# Altium project plobot.PrjPCB
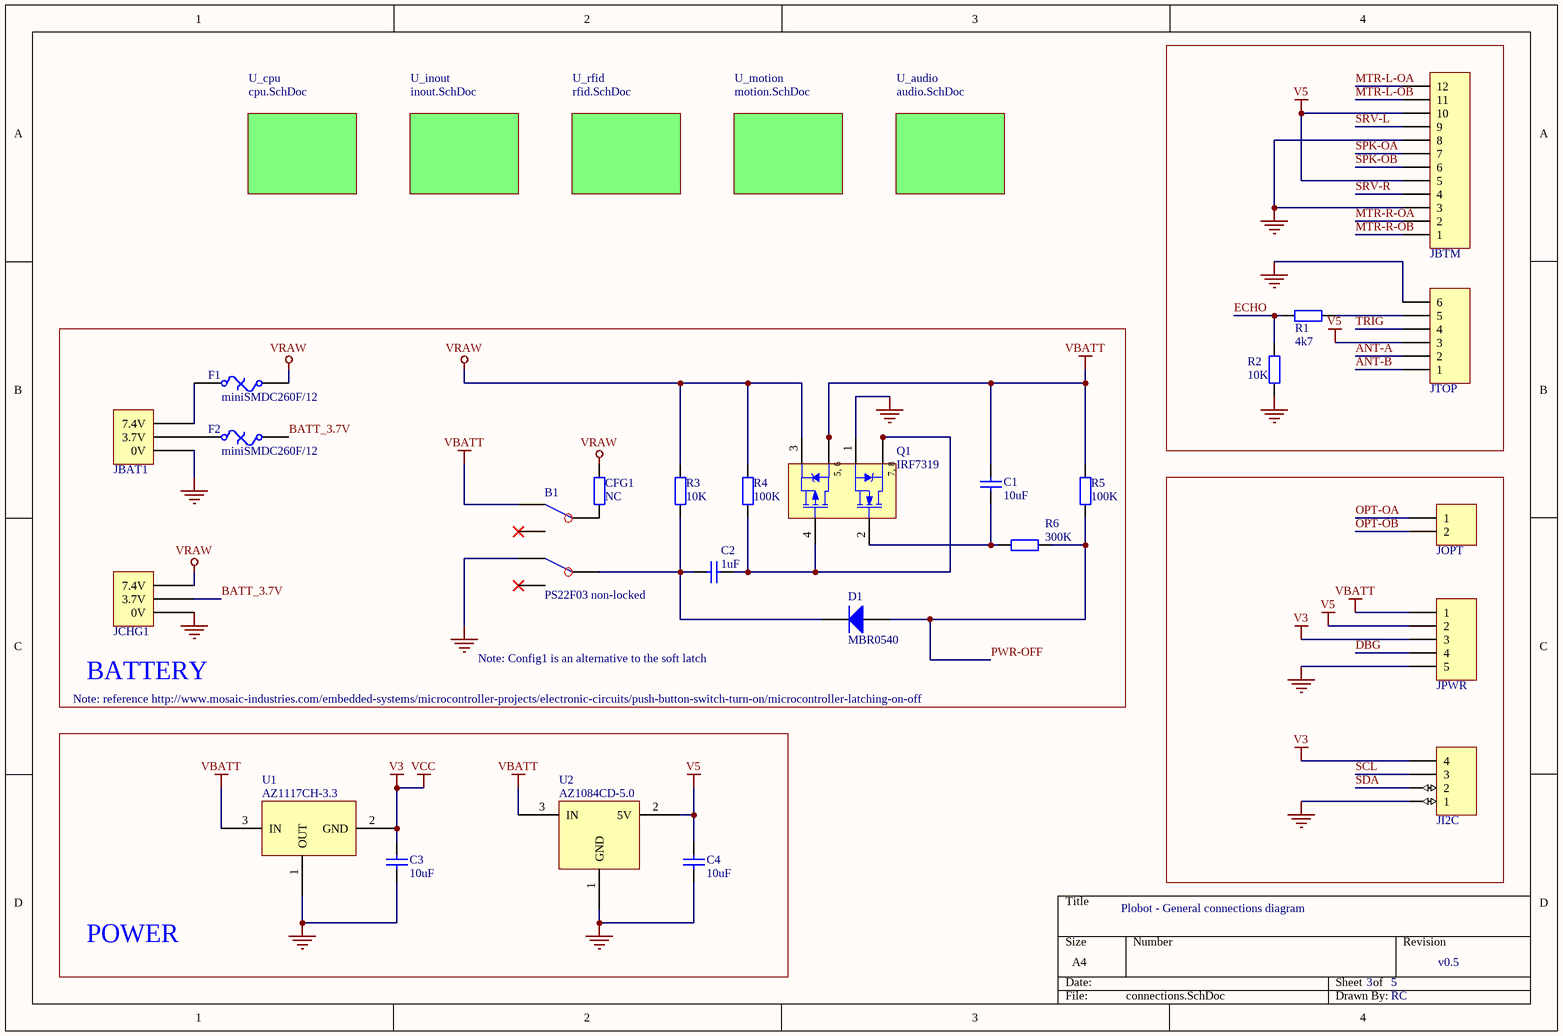
[diagram p0: connections.SchDoc]
6 sheets, 119 parts. Net scope: global (net labels, ports and power ports of the same name join across sheets).
Board file: plobot_draft.PcbDoc
Sheets:
  connections.SchDoc
    U_cpu = cpu.SchDoc
    U_inout = inout.SchDoc
    U_rfid = rfid.SchDoc
    U_motion = motion.SchDoc
    U_audio = audio.SchDoc

## Sheet connections.SchDoc
size A4; PageSetup: Record=PageOptions|CenterHorizontal=False|CenterVertical=False|PrintScale=1.00|XCorrection=1.00|YCorrection=1.00|PrintKind=1|BorderSize=5000000|LeftOffset=0|BottomOffset=0|Orientation=2|PaperLength=1000|PaperWidth=1000|Scale=100|PaperSource=7|PrintQuality=-4|MediaType=1|DitherType=10|PaperKind=A4|PrintScaleMode=0

### Parts
B1  PS22F03 non-locked  [KGPS22F03]
C1  10uF  [CAPC3216N]
C2  1uF  [CAPC3216N]
C3  10uF  [CAPC3216N]
C4  10uF  [CAPC3216N]
CFG1  NC  [RESC1608N]
D1  MBR0540  [SOD123/X.85]
F1  miniSMDC260F/12  [miniSMDC260F/12]
F2  miniSMDC260F/12  [miniSMDC260F/12]
JBAT1  Charger  [S3B-XH-A(LF)(SN)]  (value not drawn)
JBTM  Header 12  [JST-B12B-XH]  (value not drawn)
JCHG1  Charger  [S3B-XH-A( FEMALE )]  (value not drawn)
JI2C  Header 4  [HDR1X4]  (value not drawn)
JOPT  Header 2  [HDR1X2]  (value not drawn)
JPWR  Component  [HDR1X5]  (value not drawn)
JTOP  w/lock  [JST-B6B-XH]  (value not drawn)
Q1  IRF7319  [SO-8_L]
R1  value 4k7  [RESC1608N]  (hidden comment: 10k)
R2  10K  [RESC1608N]
R3  10K  [RESC1608N]
R4  100K  [RESC1608N]
R5  100K  [RESC1608N]
R6  300K  [RESC1608N]
U1  AZ1117CH-3.3  [SOT223]
U2  AZ1084CD-5.0  [AZ1084CD-5.0]

### Blocks framed on the sheet
BATTERY: B1 C1 C2 CFG1 D1 F1 F2 JBAT1 JCHG1 Q1 R3-R6
POWER: C3 C4 U1 U2

### Sub-sheets
U_audio = audio.SchDoc: no entries
U_cpu = cpu.SchDoc: no entries
U_inout = inout.SchDoc: no entries
U_motion = motion.SchDoc: no entries
U_rfid = rfid.SchDoc: no entries

### Nets
GND: B1.4 C3.2 C4.1 JBAT1.1(0V) JBTM.3 JBTM.8 JCHG1.1(0V) JI2C.1 JPWR.5 JTOP.6 Q1.1(S1) R2.2 U1.1(OUT) U2.1(GND)
V3: C3.1 JI2C.4 JPWR.3 U1.2(GND)  [also labelled VCC]
V5: C4.2 JBTM.5 JBTM.10 JPWR.2 JTOP.3 U2.2(5V)
VBATT: B1.3 C1.1 JPWR.1 Q1.5(D2) Q1.6(D2) R5.2 U1.3(IN) U2.3(IN)
VRAW: CFG1.1 F1.2 JCHG1.3(7.4V) Q1.3(S2) R3.2 R4.2
ANT-A: JTOP.2
ANT-B: JTOP.1
BATT_3.7V: F2.2 JCHG1.2(3.7V)
DBG: JPWR.4
ECHO: R1.1 R2.1
MTR-L-OA: JBTM.12
MTR-L-OB: JBTM.11
MTR-R-OA: JBTM.2
MTR-R-OB: JBTM.1
OPT-OA: JOPT.1
OPT-OB: JOPT.2
PWR-OFF: D1.2(A) R5.1 R6.1
SCL: JI2C.3
SDA: JI2C.2
SPK-OA: JBTM.7
SPK-OB: JBTM.6
SRV-L: JBTM.9
SRV-R: JBTM.4
TRIG: JTOP.4
NetB1_2: B1.2 CFG1.2
NetB1_5: B1.5 C2.1 D1.1(K) R3.1
NetC1_2: C1.2 Q1.2(G1) R6.2
NetC2_2: C2.2 Q1.4(G2) Q1.7(D1) Q1.8(D1) R4.1
NetF1_1: F1.1 JBAT1.3(7.4V)
NetF2_1: F2.1 JBAT1.2(3.7V)
NetJTOP_5: JTOP.5 R1.2

Not connected (* = marked no-connect by the designer): B1 1* 6*

### Notes on the sheet
- Note: reference http://www.mosaic-industries.com/embedded-systems/microcontroller-projects/electronic-circuits/push-button-switch-turn-on/microcontroller-latching-on-off
- Note: Config1 is an alternative to the soft latch
- Plobot - General connections diagram
- 3
- 5
- v0.5
- RC
- (in symbol IRF7319) 5, 6; 7, 8

### Library data of the parts
B1 = Component_1
C1-C4 = Cap_2: Capacitor; PackageReference: RAD-0.3
  C1: Value: 10uF; ComponentLink2Description: Datasheet; ComponentLink3Description: DIGIKEY
  C2: Value: 1uF; ComponentLink2Description: Datasheet; ComponentLink3Description: DIGIKEY
  C3: Published: 8-Jun-2000; LatestRevisionDate: 17-Jul-2002; LatestRevisionNote: Re-released for DXP Platform.; Publisher: Altium Limited; Value: 10uF; PackageDescription: Radial Cap, Thru-Hole; 2 Leads; 0.3 in Pin Spacing
  C4: Published: 8-Jun-2000; LatestRevisionDate: 17-Jul-2002; LatestRevisionNote: Re-released for DXP Platform.; Publisher: Altium Limited; PackageDescription: Radial Cap, Thru-Hole; 2 Leads; 0.3 in Pin Spacing; Value: 10uF
CFG1 R1 R3-R6 = Res2: Resistor; PackageReference: AXIAL-0.4
  CFG1: Value: NC; ComponentLink2Description: Datasheet; ComponentLink3Description: DIGIKEY
  R1: Published: 8-Jun-2000; LatestRevisionDate: 17-Jul-2002; LatestRevisionNote: Re-released for DXP Platform.; Publisher: Altium Limited
  R3: Value: 10K; ComponentLink3Description: DIGIKEY
  R4 R5: Value: 100K; ComponentLink3Description: DIGIKEY
  R6: Value: 300K; ComponentLink3Description: DIGIKEY
D1 = Diode: Default Diode; PackageReference: SMC; ComponentLink3Description: DIGIKEY; ComponentLink3URL: http://www.digikey.com/product-detail/en/fairchild-on-semiconductor/MBR0540/MBR0540TR-ND/1048787
F1 F2 = Fuse Thermal: Thermal Fuse; Published: 24-Mar-1999; LatestRevisionDate: 17-Jul-2002; LatestRevisionNote: Re-released for DXP Platform.; PackageReference: PIN-W2/E2.8; Publisher: Altium Limited
JBAT1 JCHG1 = BATTCON: ComponentLink3Description: TAOBAO; ComponentLink3URL: https://item.taobao.com/item.htm?spm=a1z09.2.0.0.HEqzjA&id=524112080121&_u=goqqgqg0b2c
JBTM = Header 12: Header, 12-Pin; ComponentLink2Description: http://www.digikey.com/product-detail/en/jst-sales-america-inc/B12B-XH-A(LF)(SN)/455-2259-ND/1651057; ComponentLink3Description: DIGIKEY
JI2C = Header 4: Header, 4-Pin; ComponentLink3Description: DIGIKEY
JOPT = Header 2: Header, 2-Pin; LatestRevisionDate: 17-Jul-2002; LatestRevisionNote: Re-released for DXP Platform.; Publisher: Altium Limited
JPWR = Header 5: Header, 5-Pin; LatestRevisionDate: 17-Jul-2002; LatestRevisionNote: Re-released for DXP Platform.; Publisher: Altium Limited
JTOP = Header 6: Header, 6-Pin; ComponentLink2Description: http://www.digikey.com/products/en?keywords=B6B-XH-A(LF)(SN); ComponentLink3Description: DIGIKEY
Q1 = IRF7319: HEXFET Power MOSFET; PackageReference: SO-8; ComponentLink1Description: Manufacturer Link; ComponentLink1URL: http://www.irf.com/; ComponentLink2Description: Datasheet; ComponentLink2URL: http://www.irf.com/product-info/datasheets/data/IRFN140.pdf; ComponentLink3Description: DIGIKEY; ComponentLink3URL: http://www.digikey.com/product-detail/en/infineon-technologies/IRF7319TRPBF/IRF7319PBFTR-ND/812747; Price: 0.4 USD
R2 = Res2: Resistor; Value: 20k; Published: 8-Jun-2000; LatestRevisionDate: 17-Jul-2002; LatestRevisionNote: Re-released for DXP Platform.; PackageReference: AXIAL-0.4; Publisher: Altium Limited
U1 = LM1117

## Sheet cpu.SchDoc
size A4
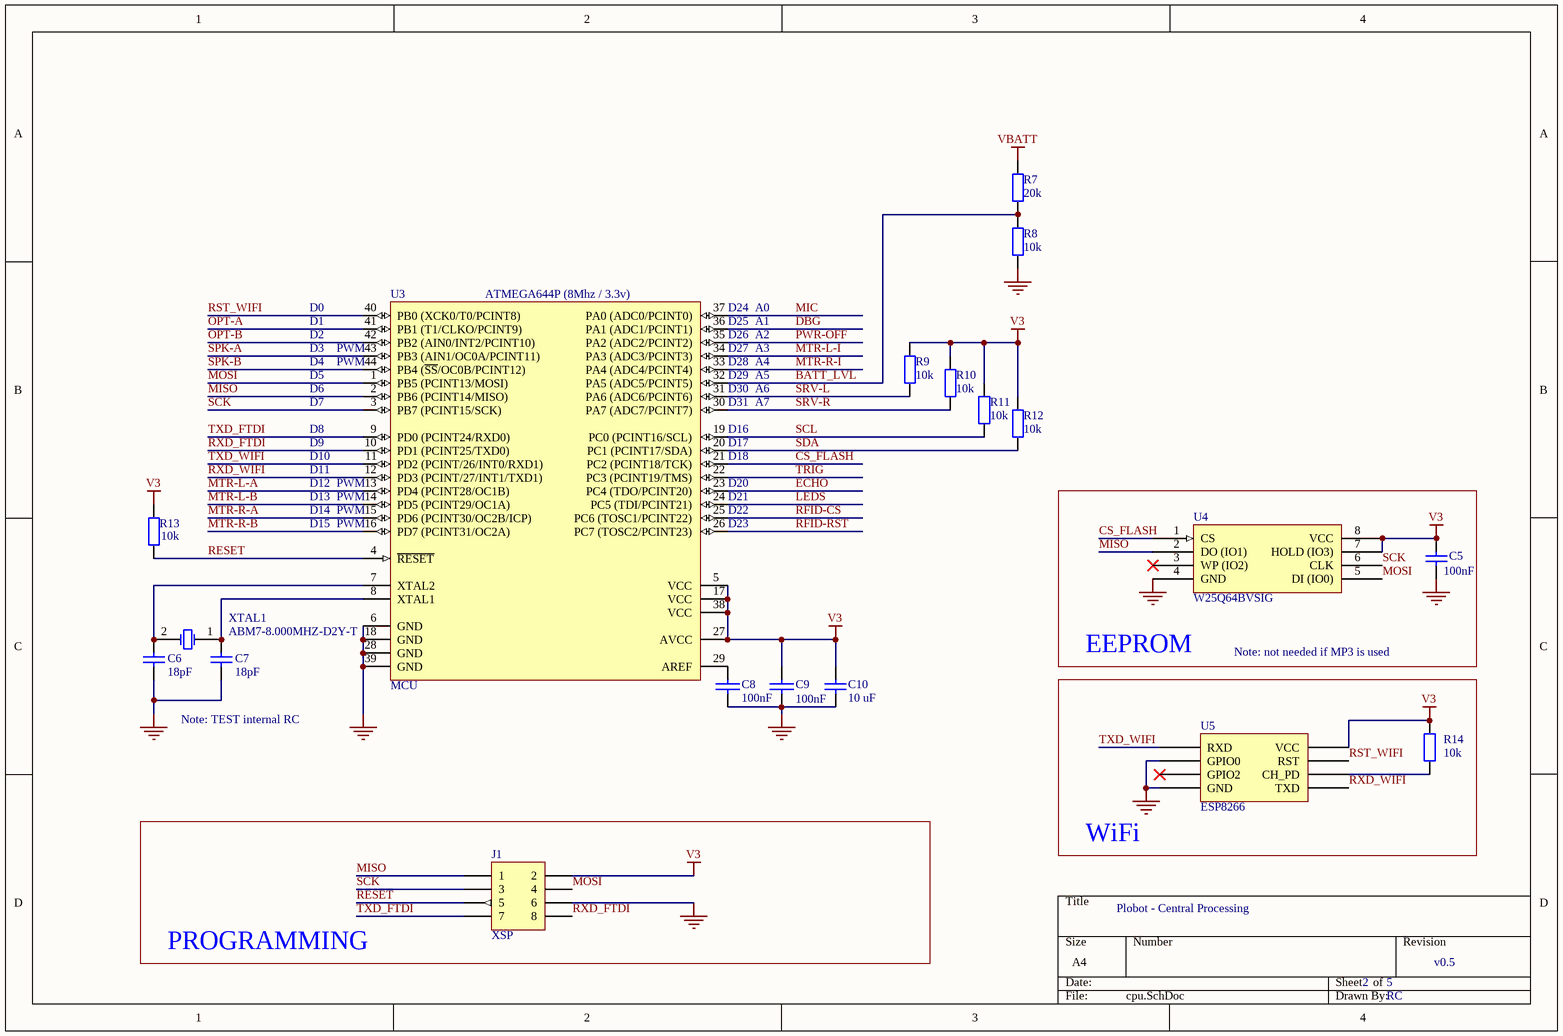
[diagram p1: cpu.SchDoc]

### Parts
C5  100nF  [CAPC1608N]
C6  18pF  [CAPC1608N]
C7  18pF  [CAPC1608N]
C8  100nF  [CAPC1608N]
C9  100nF  [CAPC1608N]
C10  10 uF  [CAPC3216N]
J1  XSP  [HDR2X4H]
R7  20k  [RESC1608N]
R8  10k  [RESC1608N]
R9  10k  [RESC1608N]
R10  10k  [RESC1608N]
R11  10k  [RESC1608N]
R12  10k  [RESC1608N]
R13  10k  [RESC1608N]
R14  10k  [RESC1608N]
U3  MCU  [atmega644p]
U4  W25Q64BVSIG  [W25Q64BVSIG]
U5  ESP8266  [ESP8266]
XTAL1  ABM7-8.000MHZ-D2Y-T  [XTAL]

### Blocks framed on the sheet
EEPROM: C5 U4
WiFi: R14 U5
PROGRAMMING: J1

### Nets
GND: C5.2 C6.1 C7.1 C8.2 C9.2 C10.1 J1.6 R8.1 U3.6(GND) U3.18(GND) U3.28(GND) U3.39(GND) U4.4(GND) U5.GND U5.GPIO0
V3: C5.1 C9.1 C10.2 J1.2 R9.1 R10.1 R11.2 R12.1 R13.1 R14.1 U3.5(VCC) U3.17(VCC) U3.27(AVCC) U3.38(VCC) U4.7(HOLD_(IO3)) U4.8(VCC) U5.VCC
VBATT: R7.2
BATT_LVL: R7.1 R8.2 U3.32(PA5_(ADC5/PCINT5))
CS_FLASH: U3.21(PC2_(PCINT18/TCK)) U4.1(CS)
DBG: U3.36(PA1_(ADC1/PCINT1))
ECHO: U3.23(PC4_(TDO/PCINT20))
LEDS: U3.24(PC5_(TDI/PCINT21))
MIC: U3.37(PA0_(ADC0/PCINT0))
MISO: J1.1 U3.2(PB6_(PCINT14/MISO)) U4.2(DO_(IO1))
MOSI: J1.4 U3.1(PB5_(PCINT13/MOSI)) U4.5(DI_(IO0))
MTR-L-A: U3.13(PD4_(PCINT28/OC1B))
MTR-L-B: U3.14(PD5_(PCINT29/OC1A))
MTR-L-I: U3.34(PA3_(ADC3/PCINT3))
MTR-R-A: U3.15(PD6_(PCINT30/OC2B/ICP))
MTR-R-B: U3.16(PD7_(PCINT31/OC2A))
MTR-R-I: U3.33(PA4_(ADC4/PCINT4))
OPT-A: U3.41(PB1_(T1/CLKO/PCINT9))
OPT-B: U3.42(PB2_(AIN0/INT2/PCINT10))
PWR-OFF: U3.35(PA2_(ADC2/PCINT2))
RESET: J1.5 R13.2 U3.4(~{RESET})
RFID-CS: U3.25(PC6_(TOSC1/PCINT22))
RFID-RST: U3.26(PC7_(TOSC2/PCINT23))
RST_WIFI: U3.40(PB0_(XCK0/T0/PCINT8)) U5.RST
RXD_FTDI: J1.8 U3.10(PD1_(PCINT25/TXD0))
RXD_WIFI: U3.12(PD3_(PCINT/27/INT1/TXD1)) U5.TXD
SCK: J1.3 U3.3(PB7_(PCINT15/SCK)) U4.6(CLK)
SCL: R11.1 U3.19(PC0_(PCINT16/SCL))
SDA: R12.2 U3.20(PC1_(PCINT17/SDA))
SPK-A: U3.43(PB3_(AIN1/OC0A/PCINT11))
SPK-B: U3.44(PB4_(~{SS}/OC0B/PCINT12))
SRV-L: R9.2 U3.31(PA6_(ADC6/PCINT6))
SRV-R: R10.2 U3.30(PA7_(ADC7/PCINT7))
TRIG: U3.22(PC3_(PCINT19/TMS))
TXD_FTDI: J1.7 U3.9(PD0_(PCINT24/RXD0))
TXD_WIFI: U3.11(PD2_(PCINT/26/INT0/RXD1)) U5.RXD
NetC6_2: C6.2 U3.7(XTAL2) XTAL1.2(OSC2)
NetC7_2: C7.2 U3.8(XTAL1) XTAL1.1(OSC1)
NetC8_1: C8.1 U3.29(AREF)
NetR14_2: R14.2 U5.CH_PD

Not connected (* = marked no-connect by the designer): U4 3(WP_(IO2))*; U5 GPIO2*

### Notes on the sheet
- D0
- (near U3) ATMEGA644P (8Mhz / 3.3v)
- (near U3) D24
- A0
- D1
- D2
- D3
- D4
- D5
- (near U3) PWM
- (near U3) D25
- (near U3) D26
- (near U3) D27
- (near U3) D28
- (near U3) D29
- A1
- A2
- A3
- A4
- A5
- D6
- D7
- D8
- D9
- (near U3) D16
- (near U3) D17
- (near U3) D30
- (near U3) D31
- A6
- A7
- D10
- D11
- D12
- D13
- D14
- (near U3) D18
- (near U3) D20
- (near U3) D21
- (near U3) D22
- D15
- (near U3) D23
- Note: not needed if MP3 is used
- Note: TEST internal RC
- Plobot - Central Processing
- 2
- 5
- v0.5
- RC

### Library data of the parts
C5-C9 = Cap: Capacitor
  C5: Published: 8-Jun-2000; LatestRevisionDate: 17-Jul-2002; LatestRevisionNote: Re-released for DXP Platform.; PackageReference: RAD-0.3; Publisher: Altium Limited; PackageDescription: Radial Cap, Thru-Hole; 2 Leads; 0.3 in Pin Spacing; Value: 100nF
  C6 C7: Published: 8-Jun-2000; LatestRevisionDate: 17-Jul-2002; LatestRevisionNote: Re-released for DXP Platform.; PackageReference: RAD-0.3; Publisher: Altium Limited; Value: 18pF
C10 = Cap_2: Capacitor; Published: 8-Jun-2000; LatestRevisionDate: 17-Jul-2002; LatestRevisionNote: Re-released for DXP Platform.; PackageReference: RAD-0.3; Publisher: Altium Limited; PackageDescription: Radial Cap, Thru-Hole; 2 Leads; 0.3 in Pin Spacing; Value: 10 uF
J1 = Header 4X2H: Header, 4-Pin, Dual row, Right Angle; LatestRevisionDate: 17-Jul-2002; LatestRevisionNote: Re-released for DXP Platform.; Publisher: Altium Limited
R7-R14 = Res2: Resistor; Published: 8-Jun-2000; LatestRevisionDate: 17-Jul-2002; LatestRevisionNote: Re-released for DXP Platform.; PackageReference: AXIAL-0.4; Publisher: Altium Limited
  R7: Value: 20k
  R8-R14: Value: 10k
U3 = ATmega644-20AU: 8-bit AVR Microcontroller, 2.7-5.5V, 20MHz, 64KB Flash, 2KB EEPROM, 4KB SRAM, 44-pin TQFP; DatasheetVersion: revN, Jul-2010; PackageVersion: revC, Oct-2010; PackageReference: 44A; PackageDescription: 44-Pin Plastic Thin Profile Quad Flat Pack, 10 x 10 x 1.0 mm Body, 0.8 mm Pitch (TQFP); Code_JEDEC: MS-026-ACB; ComponentLink1Description: Manufacturer URL; ComponentLink1URL: http://www.atmel.com/; ComponentLink2Description: ATmega644 Datasheet; ComponentLink2URL: http://www.atmel.com/dyn/resources/prod_documents/doc2593.pdf; ComponentLink3Description: ATmega644 Summary; ComponentLink3URL: http://www.atmel.com/dyn/resources/prod_documents/2593S.pdf

## Sheet inout.SchDoc
size A4
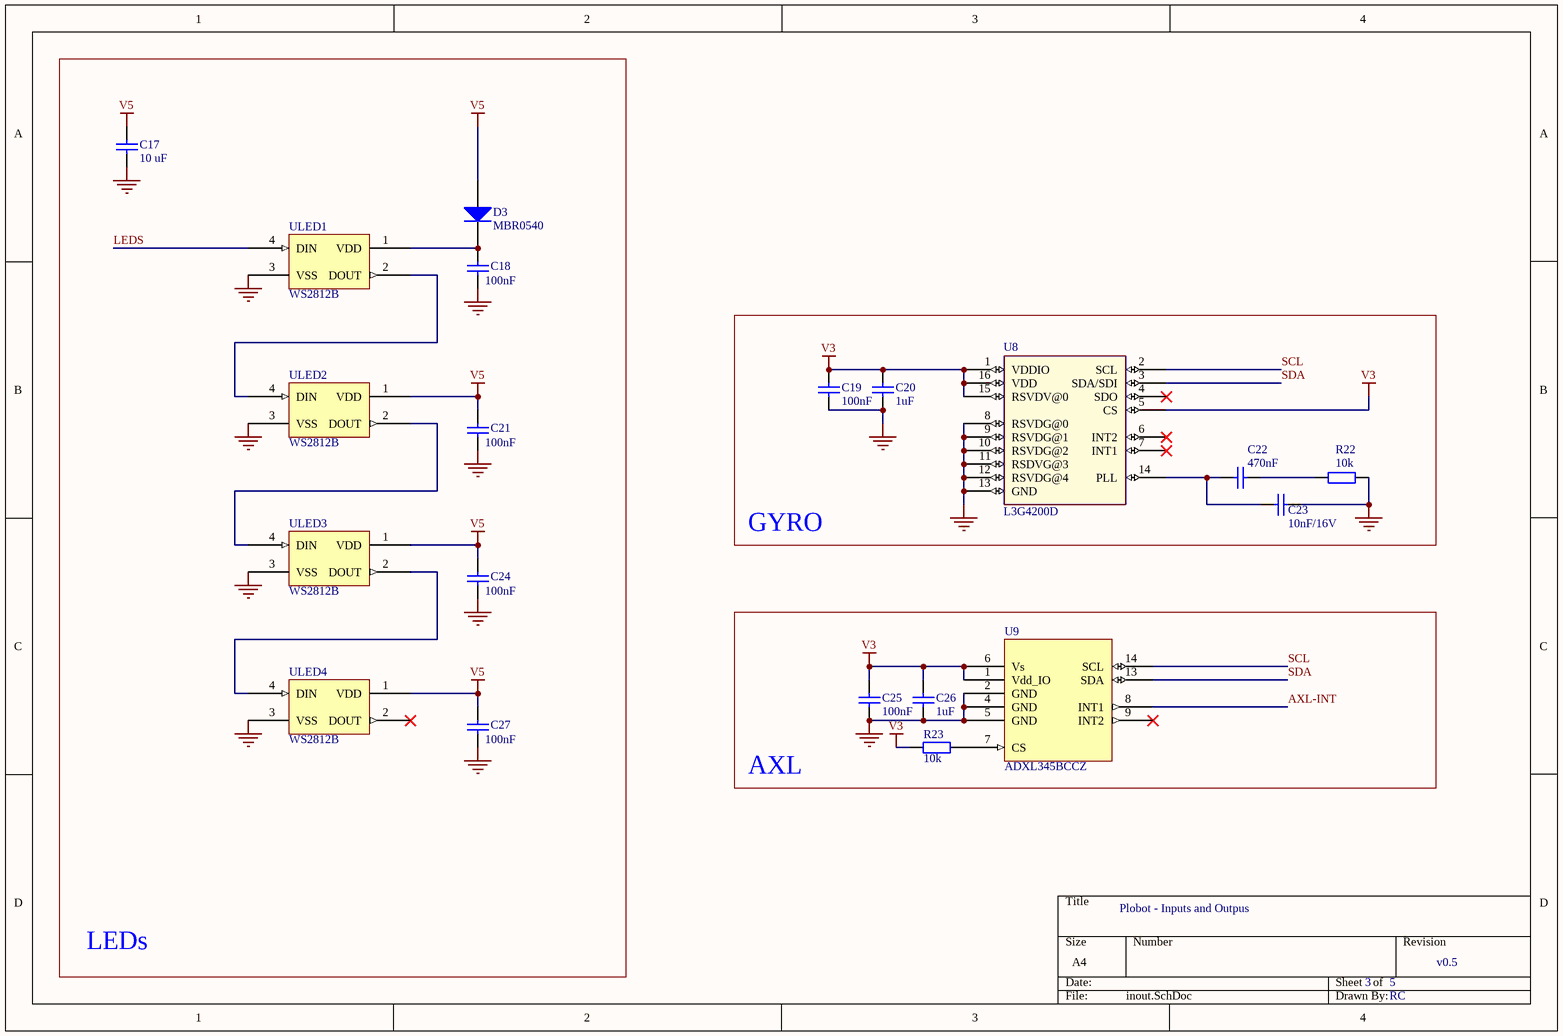
[diagram p2: inout.SchDoc]

### Parts
C17  10 uF  [CAPC3216N]
C18  100nF  [CAPC1608N]
C19  100nF  [CAPC1608N]
C20  1uF  [CAPC2012N]
C21  100nF  [CAPC1608N]
C22  470nF  [CAPC2012N]
C23  10nF/16V  [CAPC2012N]
C24  100nF  [CAPC1608N]
C25  100nF  [CAPC1608N]
C26  1uF  [CAPC2012N]
C27  100nF  [CAPC1608N]
D3  MBR0540  [SOD123/X.85]
R22  10k  [RESC1608N]
R23  10k  [RESC1608N]
U8  L3G4200D  [LGA16-4X4]
U9  ADXL345BCCZ  [ADXL345]
ULED1  WS2812B  [WS2812B]
ULED2  WS2812B  [WS2812B]
ULED3  WS2812B  [WS2812B]
ULED4  WS2812B  [WS2812B]

### Blocks framed on the sheet
LEDs: C17 C18 C21 C24 C27 D3 ULED1-ULED4
GYRO: C19 C20 C22 C23 R22 U8
AXL: C25 C26 R23 U9

### Nets
GND: C17.2 C18.2 C19.2 C20.2 C21.2 C23.2 C24.2 C25.2 C26.2 C27.2 R22.2 U8.8(RSVDG@0) U8.9(RSVDG@1) U8.10(RSVDG@2) U8.11(RSDVG@3) U8.12(RSVDG@4) U8.13(GND) U9.2(GND) U9.4(GND) U9.5(GND) ULED1.3(VSS) ULED2.3(VSS) ULED3.3(VSS) ULED4.3(VSS)
V3: C19.1 C20.1 C25.1 C26.1 R23.1 U8.1(VDDIO) U8.5(CS) U8.15(RSVDV@0) U8.16(VDD) U9.1(Vdd_IO) U9.6(Vs)
V5: C17.1 C21.1 C24.1 C27.1 D3.2(A) ULED2.1(VDD) ULED3.1(VDD) ULED4.1(VDD)
AXL-INT: U9.8(INT1)
LEDS: ULED1.4(DIN)
SCL: U8.2(SCL) U9.14(SCL)
SDA: U8.3(SDA/SDI) U9.13(SDA)
NetC18_1: C18.1 D3.1(K) ULED1.1(VDD)
NetC22_1: C22.1 C23.1 U8.14(PLL)
NetC22_2: C22.2 R22.1
NetR23_2: R23.2 U9.7(CS)
NetULED1_2: ULED1.2(DOUT) ULED2.4(DIN)
NetULED2_2: ULED2.2(DOUT) ULED3.4(DIN)
NetULED3_2: ULED3.2(DOUT) ULED4.4(DIN)

Not connected (* = marked no-connect by the designer): U8 4(SDO)* 6(INT2)* 7(INT1)*; U9 9(INT2)*; ULED4 2(DOUT)*

### Notes on the sheet
- Plobot - Inputs and Outpus
- 3
- 5
- v0.5
- RC

### Library data of the parts
C17 C20 C22 C23 C26 = Cap_2: Capacitor; PackageReference: RAD-0.3
  C17: Published: 8-Jun-2000; LatestRevisionDate: 17-Jul-2002; LatestRevisionNote: Re-released for DXP Platform.; Publisher: Altium Limited; PackageDescription: Radial Cap, Thru-Hole; 2 Leads; 0.3 in Pin Spacing; Value: 10 uF
  C20: Value: 1uF; ComponentLink3Description: DIGIKEY
  C22: Value: 470nF; ComponentLink3Description: DIGIKEY
  C23: Value: 10nF/16V; ComponentLink3Description: DIGIKEY
  C26: Published: 8-Jun-2000; LatestRevisionDate: 17-Jul-2002; LatestRevisionNote: Re-released for DXP Platform.; Publisher: Altium Limited; Value: 1uF; PackageDescription: Radial Cap, Thru-Hole; 2 Leads; 0.3 in Pin Spacing
C18 C19 C21 C24 C25 C27 = Cap: Capacitor; PackageReference: RAD-0.3; Value: 100nF
  C18 C21 C24 C25 C27: Published: 8-Jun-2000; LatestRevisionDate: 17-Jul-2002; LatestRevisionNote: Re-released for DXP Platform.; Publisher: Altium Limited; PackageDescription: Radial Cap, Thru-Hole; 2 Leads; 0.3 in Pin Spacing
  C19: ComponentLink3Description: DIGIKEY
D3 = Diode: Default Diode; Published: 8-Jun-2000; LatestRevisionDate: 17-Jul-2002; LatestRevisionNote: Re-released for DXP Platform.; PackageVersion: Sep-1996; PackageReference: SMC; Publisher: Altium Limited; Code_JEDEC: DO-214-AB
R22 R23 = Res2: Resistor; PackageReference: AXIAL-0.4; Value: 10k
  R22: ComponentLink3Description: DIGIKEY
  R23: Published: 8-Jun-2000; LatestRevisionDate: 17-Jul-2002; LatestRevisionNote: Re-released for DXP Platform.; Publisher: Altium Limited
U8 = L3G4200D: L3G4200D Series 2.4 - 3.6 V Three-axis Angular Rate MEMS Motion Sensor - LGA-16; Price: 1.5 USD; Value: *; ComponentLink3Description: DIGIKEY; ComponentLink3URL: http://www.digikey.com/product-detail/en/stmicroelectronics/L3G4200DTR/497-11071-6-ND/2587913
U9 = ADXL345

## Sheet rfid.SchDoc
size A4
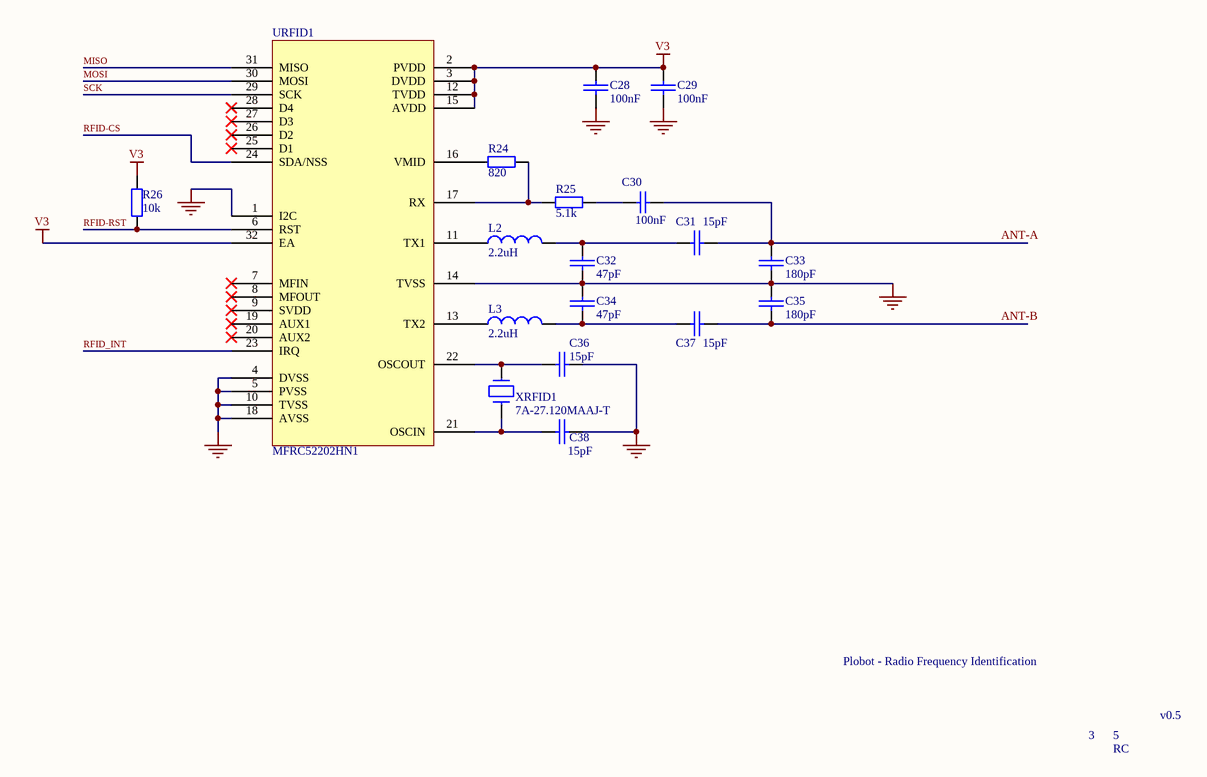
[diagram p3: rfid.SchDoc]

### Parts
C28  100nF  [CAPC1608N]
C29  100nF  [CAPC1608N]
C30  100nF  [CAPC1608N]
C31  15pF  [CAPC1608N]
C32  47pF  [CAPC1608N]
C33  180pF  [CAPC1608N]
C34  47pF  [CAPC1608N]
C35  180pF  [CAPC1608N]
C36  15pF  [CAPC1608N]
C37  15pF  [CAPC1608N]
C38  15pF  [CAPC1608N]
L2  2.2uH  [INDC1608N]
L3  2.2uH  [INDC1608N]
R24  820  [RESC1608N]
R25  5.1k  [RESC1608N]
R26  10k  [RESC1608N]
URFID1  MFRC52202HN1  [MFRC52202HN1]
XRFID1  7A-27.120MAAJ-T  [XTAL]

### Nets
GND: C28.1 C29.1 C32.1 C33.1 C34.2 C35.2 C36.2 C38.2 URFID1.1(I2C) URFID1.4(DVSS) URFID1.5(PVSS) URFID1.10(TVSS) URFID1.14(TVSS) URFID1.18(AVSS)
V3: C28.2 C29.2 R26.1 URFID1.2(PVDD) URFID1.3(DVDD) URFID1.12(TVDD) URFID1.15(AVDD) URFID1.32(EA)
ANT-A: C30.2 C31.2 C33.2
ANT-B: C35.1 C37.2
MISO: URFID1.31(MISO)
MOSI: URFID1.30(MOSI)
RFID-CS: URFID1.24(SDA/NSS)
RFID-RST: R26.2 URFID1.6(RST)
RFID_INT: URFID1.23(IRQ)
SCK: URFID1.29(SCK)
NetC30_1: C30.1 R25.1
NetC31_1: C31.1 C32.2 L2.2
NetC34_1: C34.1 C37.1 L3.2
NetC36_1: C36.1 URFID1.22(OSCOUT) XRFID1.2
NetC38_1: C38.1 URFID1.21(OSCIN) XRFID1.1
NetL2_1: L2.1 URFID1.11(TX1)
NetL3_1: L3.1 URFID1.13(TX2)
NetR24_1: R24.1 R25.2 URFID1.17(RX)
NetR24_2: R24.2 URFID1.16(VMID)

Not connected (* = marked no-connect by the designer): URFID1 7(MFIN)* 8(MFOUT)* 9(SVDD)* 19(AUX1)* 20(AUX2)* 25(D1)* 26(D2)* 27(D3)* 28(D4)*

### Notes on the sheet
- Plobot - Radio Frequency Identification
- 3
- 5
- v0.5
- RC

### Library data of the parts
C28-C38 = Cap: Capacitor
  C30: Published: 8-Jun-2000; LatestRevisionDate: 17-Jul-2002; LatestRevisionNote: Re-released for DXP Platform.; PackageReference: RAD-0.3; Publisher: Altium Limited; PackageDescription: Radial Cap, Thru-Hole; 2 Leads; 0.3 in Pin Spacing; Value: 100nF
L2 L3 = Inductor: Code_IEC: 1005; Published: 8-Jun-2000; LatestRevisionDate: 29-May-2009; LatestRevisionNote: IPC-7351 Footprint Added.; PackageReference: 0402-A; Publisher: Altium Limited; PackageDescription: Chip Inductor; Code_JEITA: 0402; Value: 2.2uH
R24-R26 = Res2: Resistor; Published: 8-Jun-2000; LatestRevisionDate: 17-Jul-2002; LatestRevisionNote: Re-released for DXP Platform.; PackageReference: AXIAL-0.4; Publisher: Altium Limited
  R24: Value: 820
  R25: Value: 5.1k
  R26: Value: 10k
XRFID1 = Tm08B.S01_12M_42

## Sheet motion.SchDoc
size A4
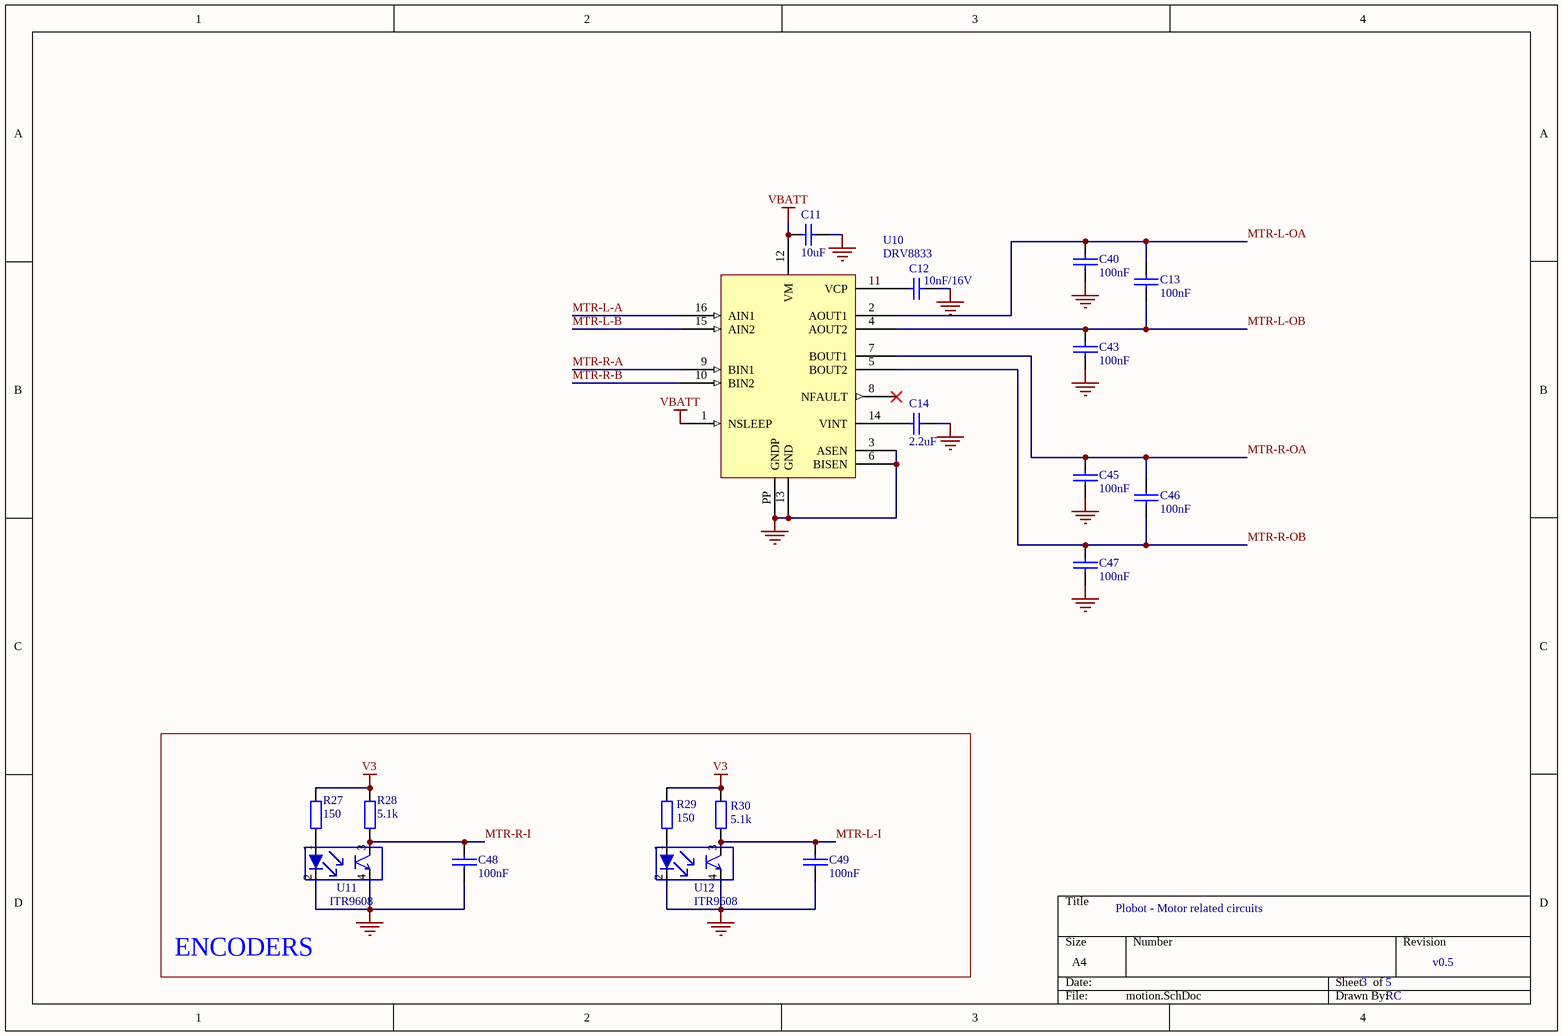
[diagram p4: motion.SchDoc]

### Parts
C11  10uF  [CAPC3216N]
C12  10nF/16V  [CAPC2012N]
C13  100nF  [CAPC1608N]
C14  2.2uF  [CAPC2012N]
C40  100nF  [CAPC1608N]
C43  100nF  [CAPC1608N]
C45  100nF  [CAPC1608N]
C46  100nF  [CAPC1608N]
C47  100nF  [CAPC1608N]
C48  100nF  [CAPC1608N]
C49  100nF  [CAPC1608N]
R27  value 150  [RESC1608N]  (hidden comment: 1K)
R28  5.1k  [RESC1608N]
R29  value 150  [RESC1608N]  (hidden comment: 1K)
R30  5.1k  [RESC1608N]
U10  DRV8833  [DRV8833]
U11  ITR9608  [ITR9608]
U12  ITR9608  [ITR9608]

### Blocks framed on the sheet
ENCODERS: C48 C49 R27-R30 U11 U12

### Nets
GND: C11.1 C12.1 C14.1 C40.1 C43.1 C45.1 C47.1 C48.1 C49.1 U10.3(ASEN) U10.6(BISEN) U10.13(GND) U10.PP(GNDP) U11.2(CATHODE) U11.4(ENITIER) U12.2(CATHODE) U12.4(ENITIER)
V3: R27.2 R28.2 R29.2 R30.2
VBATT: C11.2 U10.1(NSLEEP) U10.12(VM)
MTR-L-A: U10.16(AIN1)
MTR-L-B: U10.15(AIN2)
MTR-L-I: C49.2 R30.1 U12.3(COLLECTOR)
MTR-L-OA: C13.2 C40.2 U10.2(AOUT1)
MTR-L-OB: C13.1 C43.2 U10.4(AOUT2)
MTR-R-A: U10.9(BIN1)
MTR-R-B: U10.10(BIN2)
MTR-R-I: C48.2 R28.1 U11.3(COLLECTOR)
MTR-R-OA: C45.2 C46.2 U10.7(BOUT1)
MTR-R-OB: C46.1 C47.2 U10.5(BOUT2)
NetC12_2: C12.2 U10.11(VCP)
NetC14_2: C14.2 U10.14(VINT)
NetR27_1: R27.1 U11.1(ANODE)
NetR29_1: R29.1 U12.1(ANODE)

Not connected (* = marked no-connect by the designer): U10 8(NFAULT)*

### Notes on the sheet
- Plobot - Motor related circuits
- 3
- 5
- v0.5
- RC

### Library data of the parts
C11 = Cap_2: Capacitor; Published: 8-Jun-2000; LatestRevisionDate: 17-Jul-2002; LatestRevisionNote: Re-released for DXP Platform.; PackageReference: RAD-0.3; Publisher: Altium Limited; PackageDescription: Radial Cap, Thru-Hole; 2 Leads; 0.3 in Pin Spacing; Value: 10uF
C12-C14 C40 C43 C45-C49 = Cap: Capacitor
  C12: Published: 8-Jun-2000; LatestRevisionDate: 17-Jul-2002; LatestRevisionNote: Re-released for DXP Platform.; PackageReference: RAD-0.3; Publisher: Altium Limited; PackageDescription: Radial Cap, Thru-Hole; 2 Leads; 0.3 in Pin Spacing; Value: 10nF/16V
  C14: Published: 8-Jun-2000; LatestRevisionDate: 17-Jul-2002; LatestRevisionNote: Re-released for DXP Platform.; PackageReference: RAD-0.3; Publisher: Altium Limited; PackageDescription: Radial Cap, Thru-Hole; 2 Leads; 0.3 in Pin Spacing; Value: 2.2uF
R27-R30 = Res2: Resistor; Published: 8-Jun-2000; LatestRevisionDate: 17-Jul-2002; LatestRevisionNote: Re-released for DXP Platform.; PackageReference: AXIAL-0.4; Publisher: Altium Limited
  R28 R30: Value: 5.1k

## Sheet audio.SchDoc
size A4
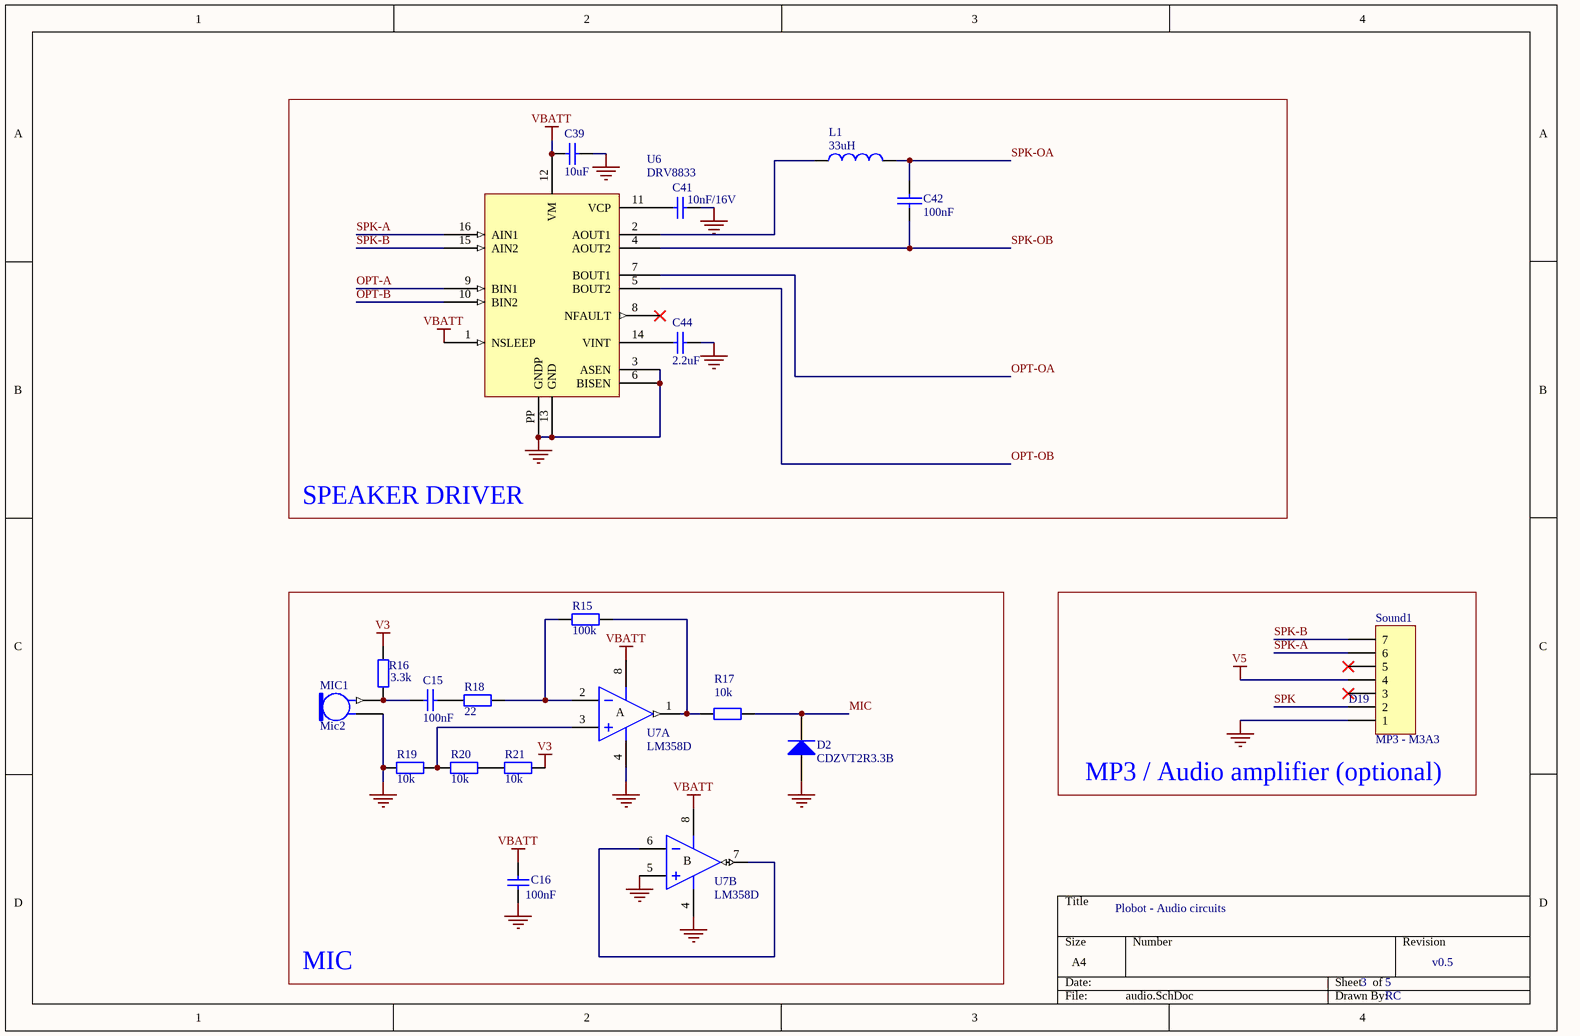
[diagram p5: audio.SchDoc]

### Parts
C15  100nF  [CAPC1608N]
C16  100nF  [CAPC1608N]
C39  10uF  [CAPC3216N]
C41  10nF/16V  [CAPC2012N]
C42  100nF  [CAPC1608N]
C44  2.2uF  [CAPC2012N]
D2  CDZVT2R3.3B  [SOD123/X.85]
L1  value 33uH  [INDC1608N]  (hidden comment: Inductor)
MIC1  Mic2  [electret_6mm]
R15  100k  [RESC1608N]
R16  3.3k  [RESC1608N]
R17  10k  [RESC1608N]
R18  22  [RESC1608N]
R19  10k  [RESC1608N]
R20  10k  [RESC1608N]
R21  10k  [RESC1608N]
Sound1  MP3 - M3A3  [MP3]
U6  DRV8833  [DRV8833]
U7  LM358D  [LM358D]  (parts A,B of 2)

### Blocks framed on the sheet
SPEAKER DRIVER: C39 C41 C42 C44 L1 U6
MIC: C15 C16 D2 MIC1 R15-R21 U7
MP3 / Audio amplifier (optional): Sound1

### Nets
GND: C16.2 C39.1 C41.1 C44.1 D2.2(A) MIC1.2 R19.1 Sound1.1 U6.3(ASEN) U6.6(BISEN) U6.13(GND) U6.PP(GNDP) U7.4(V-) U7.5(IN+)
V3: R16.1 R21.2
V5: Sound1.4
VBATT: C16.1 C39.2 U6.1(NSLEEP) U6.12(VM) U7.8(V+)
MIC: D2.1(K) R17.2
OPT-A: U6.9(BIN1)
OPT-B: U6.10(BIN2)
OPT-OA: U6.7(BOUT1)
OPT-OB: U6.5(BOUT2)
SPK: Sound1.2
SPK-A: Sound1.6 U6.16(AIN1)
SPK-B: Sound1.7 U6.15(AIN2)
SPK-OA: C42.2 L1.2
SPK-OB: C42.1 U6.4(AOUT2)
NetC15_1: C15.1 R18.1
NetC15_2: C15.2 MIC1.1 R16.2
NetC41_2: C41.2 U6.11(VCP)
NetC44_2: C44.2 U6.14(VINT)
NetL1_1: L1.1 U6.2(AOUT1)
NetR15_1: R15.1 R18.2 U7.2(IN-)
NetR15_2: R15.2 R17.1 U7.1(OUT)
NetR19_2: R19.2 R20.1 U7.3(IN+)
NetR20_2: R20.2 R21.1
NetU7_6: U7.6(IN-) U7.7(OUT)

Not connected (* = marked no-connect by the designer): Sound1 3* 5*; U6 8(NFAULT)*

### Notes on the sheet
- (near Sound1) D19
- Plobot - Audio circuits
- 3
- 5
- v0.5
- RC
- (in symbol LM358D, part A) A
- (in symbol LM358D, part B) B

### Library data of the parts
C15 C16 C41 C42 C44 = Cap: Capacitor
  C15 C16: Published: 8-Jun-2000; LatestRevisionDate: 17-Jul-2002; LatestRevisionNote: Re-released for DXP Platform.; PackageReference: RAD-0.3; Publisher: Altium Limited; PackageDescription: Radial Cap, Thru-Hole; 2 Leads; 0.3 in Pin Spacing; Value: 100nF
  C41: Published: 8-Jun-2000; LatestRevisionDate: 17-Jul-2002; LatestRevisionNote: Re-released for DXP Platform.; PackageReference: RAD-0.3; Publisher: Altium Limited; PackageDescription: Radial Cap, Thru-Hole; 2 Leads; 0.3 in Pin Spacing; Value: 10nF/16V
  C44: Published: 8-Jun-2000; LatestRevisionDate: 17-Jul-2002; LatestRevisionNote: Re-released for DXP Platform.; PackageReference: RAD-0.3; Publisher: Altium Limited; PackageDescription: Radial Cap, Thru-Hole; 2 Leads; 0.3 in Pin Spacing; Value: 2.2uF
C39 = Cap_2: Capacitor; Published: 8-Jun-2000; LatestRevisionDate: 17-Jul-2002; LatestRevisionNote: Re-released for DXP Platform.; PackageReference: RAD-0.3; Publisher: Altium Limited; PackageDescription: Radial Cap, Thru-Hole; 2 Leads; 0.3 in Pin Spacing; Value: 10uF
D2 = Diode: Default Diode; Published: 8-Jun-2000; LatestRevisionDate: 17-Jul-2002; LatestRevisionNote: Re-released for DXP Platform.; PackageVersion: Sep-1996; PackageReference: SMC; Publisher: Altium Limited; Code_JEDEC: DO-214-AB
L1 = Inductor: Code_IEC: 1005; Published: 8-Jun-2000; LatestRevisionDate: 29-May-2009; LatestRevisionNote: IPC-7351 Footprint Added.; PackageReference: 0402-A; Publisher: Altium Limited; PackageDescription: Chip Inductor; Code_JEITA: 0402
MIC1 = Mic2: Microphone; Published: *; LatestRevisionDate: *; LatestRevisionNote: *; PackageReference: *; Publisher: *
R15-R21 = Res2: Resistor; Published: 8-Jun-2000; LatestRevisionDate: 17-Jul-2002; LatestRevisionNote: Re-released for DXP Platform.; PackageReference: AXIAL-0.4; Publisher: Altium Limited
  R15: Value: 100k
  R16: Value: 3.3k
  R17 R19-R21: Value: 10k
  R18: Value: 22
Sound1 = Header 7: Header, 7-Pin; ComponentLink3Description: DIGIKEY
U7 = LM358D: Dual Operational Amplifier; Published: 16-Jan-2001; LatestRevisionDate: 13-Apr-2006; LatestRevisionNote: IPC-7351 Footprint Added.; DatasheetVersion: Jul-1998; PackageVersion: Jan-1998; PackageReference: D008; Publisher: Altium Limited; PackageDescription: 8-Pin Small Outline Integrated Circuit 1.27 mm Pitch; Code_IPC: SOIC127P600-8; ComponentLink1Description: Manufacturer Link; ComponentLink1URL: http://www.ti.com/; ComponentLink2Description: Datasheet; ComponentLink2URL: http://www-s.ti.com/sc/ds/lm358.pdf

## Nets that join several sheets
GND: connections (14 pins), cpu (15 pins), inout (24 pins), rfid (14 pins), motion (17 pins), audio (14 pins)
V3: connections (C3.1 JI2C.4 JPWR.3 U1.2), cpu (17 pins), inout (11 pins), rfid (8 pins), motion (R27.2 R28.2 R29.2 R30.2), audio (R16.1 R21.2)
V5: connections (6 pins), inout (8 pins), audio (Sound1.4)
VBATT: connections (8 pins), cpu (R7.2), motion (C11.2 U10.1 U10.12), audio (5 pins)
ANT-A: connections (JTOP.2), rfid (C30.2 C31.2 C33.2)
ANT-B: connections (JTOP.1), rfid (C35.1 C37.2)
DBG: connections (JPWR.4), cpu (U3.36)
ECHO: connections (R1.1 R2.1), cpu (U3.23)
LEDS: cpu (U3.24), inout (ULED1.4)
MIC: cpu (U3.37), audio (D2.1 R17.2)
MISO: cpu (J1.1 U3.2 U4.2), rfid (URFID1.31)
MOSI: cpu (J1.4 U3.1 U4.5), rfid (URFID1.30)
MTR-L-A: cpu (U3.13), motion (U10.16)
MTR-L-B: cpu (U3.14), motion (U10.15)
MTR-L-I: cpu (U3.34), motion (C49.2 R30.1 U12.3)
MTR-L-OA: connections (JBTM.12), motion (C13.2 C40.2 U10.2)
MTR-L-OB: connections (JBTM.11), motion (C13.1 C43.2 U10.4)
MTR-R-A: cpu (U3.15), motion (U10.9)
MTR-R-B: cpu (U3.16), motion (U10.10)
MTR-R-I: cpu (U3.33), motion (C48.2 R28.1 U11.3)
MTR-R-OA: connections (JBTM.2), motion (C45.2 C46.2 U10.7)
MTR-R-OB: connections (JBTM.1), motion (C46.1 C47.2 U10.5)
OPT-A: cpu (U3.41), audio (U6.9)
OPT-B: cpu (U3.42), audio (U6.10)
OPT-OA: connections (JOPT.1), audio (U6.7)
OPT-OB: connections (JOPT.2), audio (U6.5)
PWR-OFF: connections (D1.2 R5.1 R6.1), cpu (U3.35)
RFID-CS: cpu (U3.25), rfid (URFID1.24)
RFID-RST: cpu (U3.26), rfid (R26.2 URFID1.6)
SCK: cpu (J1.3 U3.3 U4.6), rfid (URFID1.29)
SCL: connections (JI2C.3), cpu (R11.1 U3.19), inout (U8.2 U9.14)
SDA: connections (JI2C.2), cpu (R12.2 U3.20), inout (U8.3 U9.13)
SPK-A: cpu (U3.43), audio (Sound1.6 U6.16)
SPK-B: cpu (U3.44), audio (Sound1.7 U6.15)
SPK-OA: connections (JBTM.7), audio (C42.2 L1.2)
SPK-OB: connections (JBTM.6), audio (C42.1 U6.4)
SRV-L: connections (JBTM.9), cpu (R9.2 U3.31)
SRV-R: connections (JBTM.4), cpu (R10.2 U3.30)
TRIG: connections (JTOP.4), cpu (U3.22)